# EAGLE design Startgate Controller Motherboard (EAGLE 7.7.0)
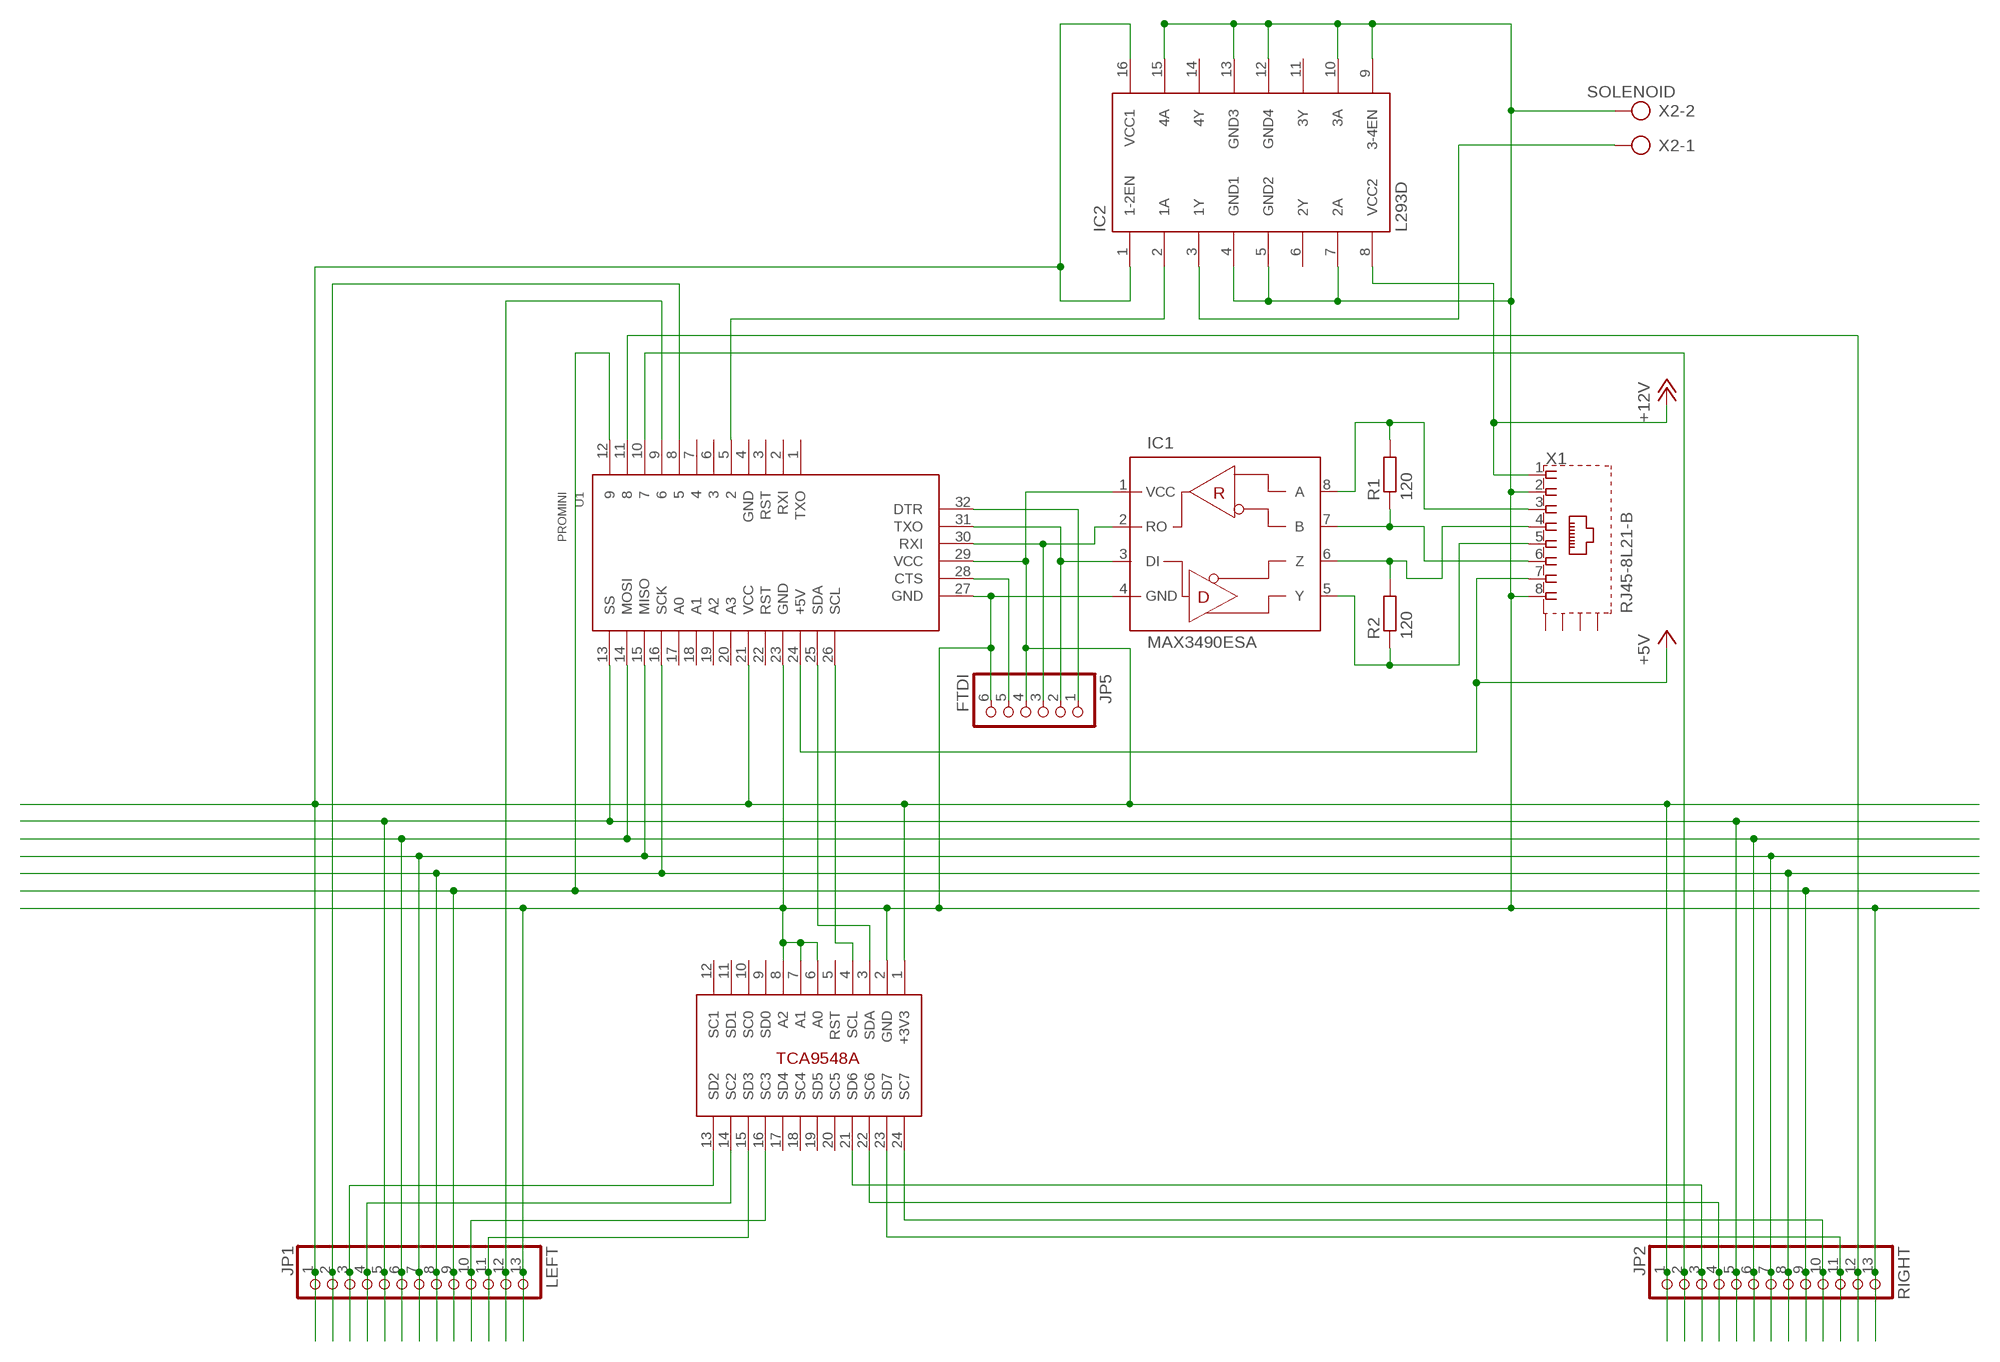
[diagram p0: schematic, sheet 1]

## Parts
IC1  MAX3490ESA  [SO08]
IC2  L293D  [DIL16]
JP1  LEFT  PINHD-1X13  [1X13]
JP2  RIGHT  PINHD-1X13  [1X13]
JP5  FTDI  PINHD-1X6  [1X06]
R1  120  R-EU_R0805  [R0805]
R2  120  R-EU_R0805  [R0805]
U1  PROMINI  ARDUINOPROMINI  [ARDUINOPROMINI]
U2  TCA9548A  [DIL24]
X1  RJ45-8L21-B  [RJ45-SHIELD1]
X2  SOLENOID  AK300/2  [AK300/2]

## Nets
+3V3: IC1.1(VCC) IC2.1(1-2EN) IC2.16(VCC1) JP1.1 JP2.1 JP5.4 U1.21(VCC) U1.29(VCC) U2.1(+3V3)
+5V: U1.24(+5V) X1.7
+12V: IC2.8(VCC2) X1.1
ENA1: JP1.2 U1.8
ENA2: JP1.12 U1.9
ENA3: JP2.2 U1.10
ENA4: JP2.12 U1.11
GND: IC1.4(GND) IC2.4(GND1) IC2.5(GND2) IC2.7(2A) IC2.9(3-4EN) IC2.10(3A) IC2.12(GND4) IC2.13(GND3) IC2.15(4A) JP1.13 JP2.13 JP5.6 U1.23(GND) U1.27(GND) U2.2(GND) U2.6(A0) U2.7(A1) U2.8(A2) X1.2 X1.8 X2.2
MISO: JP1.7 JP2.7 U1.15(MISO)
MOSI: JP1.6 JP2.6 U1.14(MOSI)
N$1: IC1.3(DI) JP5.2 U1.31(TXO)
N$2: IC1.2(RO) JP5.3 U1.30(RXI)
N$3: IC1.8(A) R1.2 X1.3
N$4: IC1.7(B) R1.1 X1.6
N$5: U1.26(SCL) U2.4(SCL)
N$6: U1.25(SDA) U2.3(SDA)
N$7: IC1.5(Y) R2.1 X1.5
N$8: IC1.6(Z) R2.2 X1.4
N$9: JP5.1 U1.32(DTR)
N$10: IC2.2(1A) U1.5
N$11: IC2.3(1Y) X2.1
N$12: JP5.5 U1.28(CTS)
RST: JP1.9 JP2.9 U1.12
SCK: JP1.8 JP2.8 U1.16(SCK)
SCL1: JP1.4 U2.14(SC2)
SCL2: JP1.10 U2.16(SC3)
SCL3: JP2.4 U2.22(SC6)
SCL4: JP2.10 U2.24(SC7)
SDA1: JP1.3 U2.13(SD2)
SDA2: JP1.11 U2.15(SD3)
SDA3: JP2.3 U2.21(SD6)
SDA4: JP2.11 U2.23(SD7)
SS: JP1.5 JP2.5 U1.13(SS)
Unconnected: IC2.6(2Y) IC2.11(3Y) IC2.14(4Y) U1.1(TXO) U1.2(RXI) U1.3(RST) U1.4(GND) U1.6 U1.7 U1.17(A0) U1.18(A1) U1.19(A2) U1.20(A3) U1.22(RST) U2.5(RST) U2.9(SD0) U2.10(SC0) U2.11(SD1) U2.12(SC1) U2.17(SD4) U2.18(SC4) U2.19(SD5) U2.20(SC5) X1.S1(S) X1.S2(S) X1.S3(S) X1.S4(S)

## Library data of the parts
IC1 = miro:MAX3490: +3.3V 10Mbps, RS-485 Transceivers
IC2 = st-microelectronics:L293D: PUSH-PULL 4 CHANNEL DRIVER; MPN: L293D; OC_FARNELL: 9589619; OC_NEWARK: 56P8249
JP1 JP2 = pinhead:PINHD-1X13: PIN HEADER
JP5 = pinhead:PINHD-1X6: PIN HEADER
R1 R2 = resistor:R-EU_: RESISTOR, European symbol
U1 = miro:ARDUINOPROMINI: Arduino Pro Mini - the compete module
U2 = miro:TCA9548A: TCA9548A is a low-voltage 8-channel I2C multiplexer
X1 = con-tycoelectronics:RJ45*2: RJ45 Low Profile Shield Type 2 For all RJ45 L, LC, LCT and X Series Models Source: www.tycoelectronics.com .. ENG_DS_1654001_1099_RJ_L_0507.pdf; OC_FARNELL: unknown; OC_NEWARK: unknown
X2 = con-ptr500:AK300/2: CONNECTOR; OC_FARNELL: unknown; OC_NEWARK: unknown

## Board
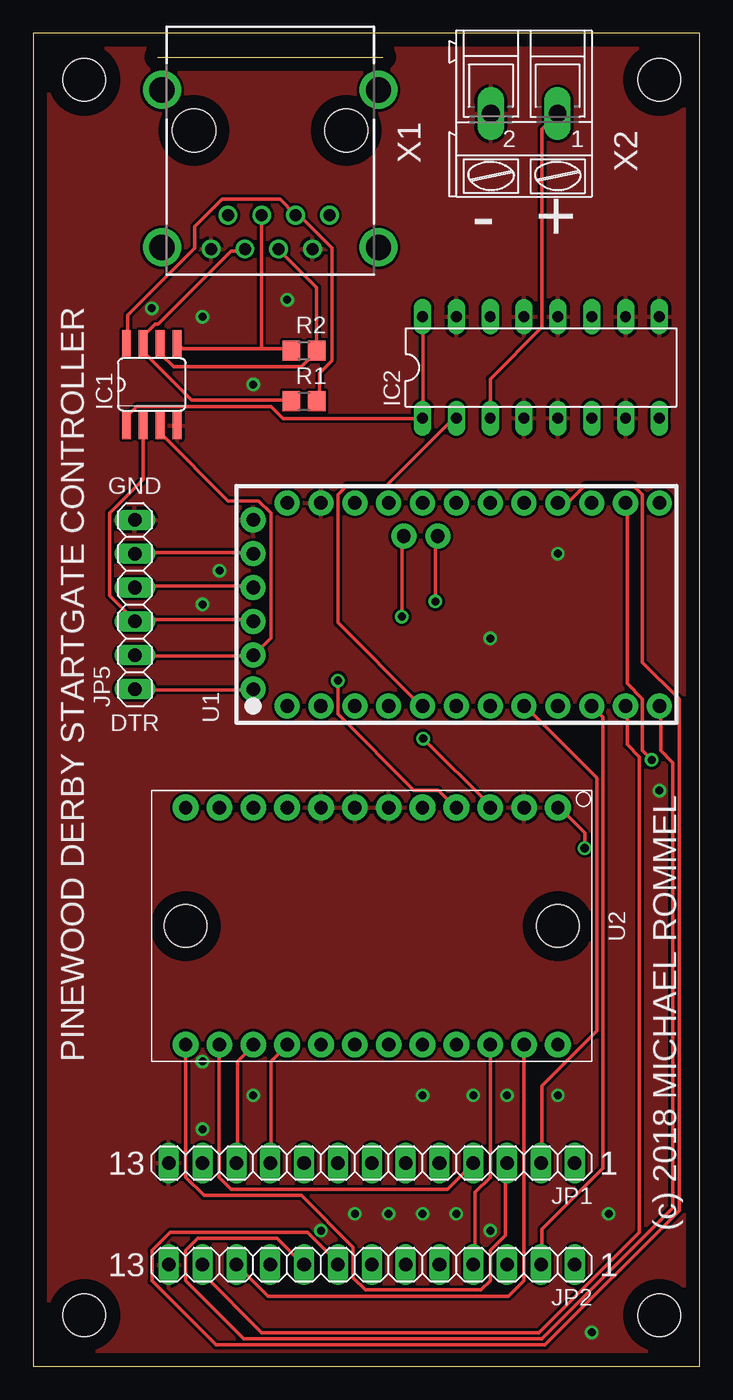
[diagram p1: board, top side]
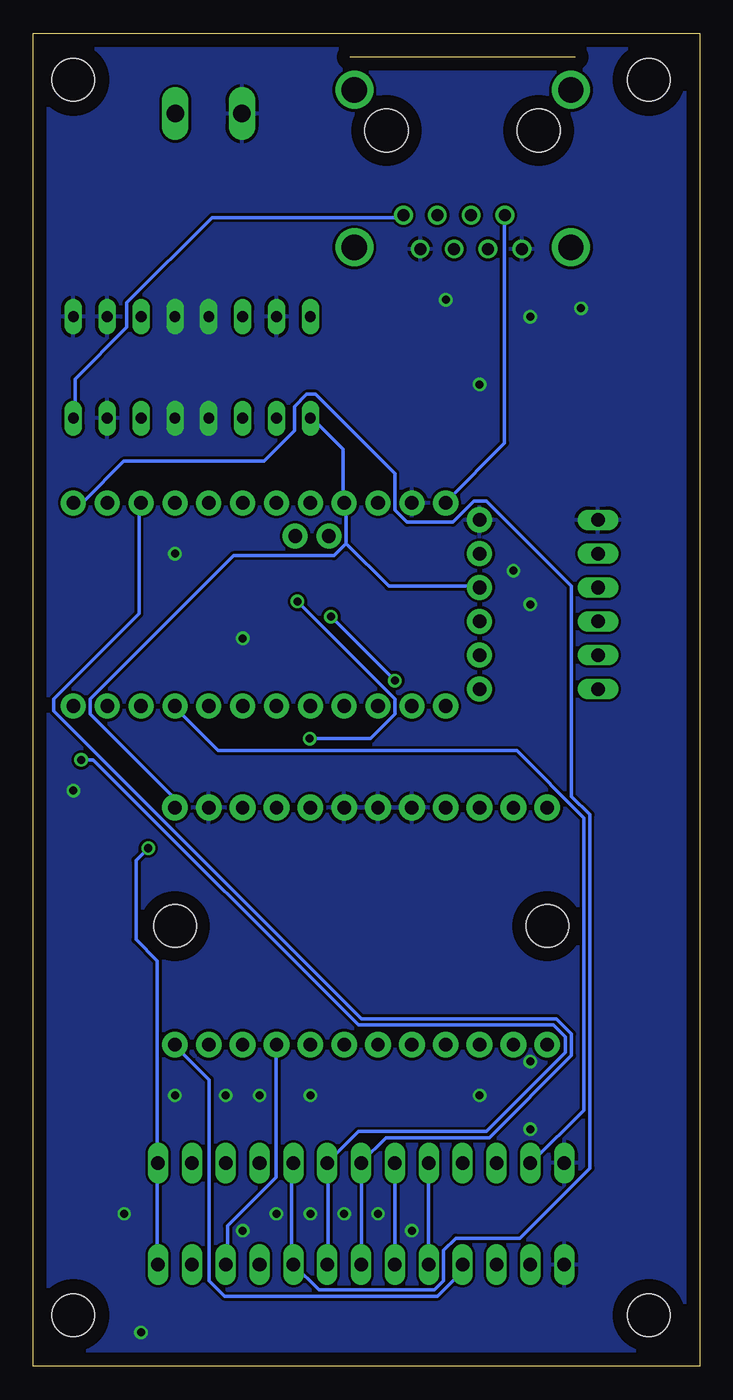
[diagram p2: board, bottom side, seen from below]

Size 50 x 100 mm. Coordinates in mm from the lower left corner, seen from the top.
Outline: 0,0 50,0 50,100 0,100 0,0
Copper layers (1*16): Top 0.035mm / dielectric 1.5mm / Bottom 0.035mm
Design rules "default": minimum track width 10mil, minimum drill 24mil, track to track 8mil, track to pad 8mil, pad to pad 8mil, via to via 8mil, smd to smd 8mil, copper to edge 40mil, drill to drill 8mil, minimum pad ring 10mil, minimum via ring 8mil, stop-mask expansion 4mil, vias tented up to drill 0mil, thermal gap 10mil
Holes 3.2 mm at 3.81,96.52 46.99,96.52 3.81,3.81 46.99,3.81
tRestrict: area 1.3,94 to 6.3,99.1; area 44.5,94 to 49.5,99.1; area 44.5,1.3 to 49.5,6.3; area 1.3,1.3 to 6.3,6.3
bRestrict: area 1.3,94 to 6.3,99.1; area 44.5,94 to 49.5,99.1; area 44.5,1.3 to 49.5,6.3; area 1.3,1.3 to 6.3,6.3

### Footprints (pad centres in the part's own frame; a part is rotated, then mirrored left to right if it is on the bottom)
SO08 = smd 0.66 x 2.032: 1 -1.905,-3.073; 2 -0.635,-3.073; 3 0.635,-3.073; 4 1.905,-3.073; 5 1.905,3.073; 6 0.635,3.073; 7 -0.635,3.073; 8 -1.905,3.073
DIL16 = drill 0.813 long: 1 -8.89,-3.81; 2 -6.35,-3.81; 3 -3.81,-3.81; 4 -1.27,-3.81; 5 1.27,-3.81; 6 3.81,-3.81; 7 6.35,-3.81; 8 8.89,-3.81; 9 8.89,3.81; 10 6.35,3.81; 11 3.81,3.81; 12 1.27,3.81; 13 -1.27,3.81; 14 -3.81,3.81; 15 -6.35,3.81; 16 -8.89,3.81
1X13 = drill 1.016 long: 1 -15.24,0; 2 -12.7,0; 3 -10.16,0; 4 -7.62,0; 5 -5.08,0; 6 -2.54,0; 7 0,0; 8 2.54,0; 9 5.08,0; 10 7.62,0; 11 10.16,0; 12 12.7,0; 13 15.24,0
1X06 = drill 1.016 long: 1 -6.35,0; 2 -3.81,0; 3 -1.27,0; 4 1.27,0; 5 3.81,0; 6 6.35,0
R0805 = smd 1.3 x 1.5: 1 -0.95,0; 2 0.95,0
ARDUINOPROMINI = drill 1.016 pad 1.88: 1 1.27,29.21; 2 1.27,26.67; 3 1.27,24.13; 4 1.27,21.59; 5 1.27,19.05; 6 1.27,16.51; 7 1.27,13.97; 8 1.27,11.43; 9 1.27,8.89; 10 1.27,6.35; 11 1.27,3.81; 12 1.27,1.27; 13 16.51,1.27; 14 16.51,3.81; 15 16.51,6.35; 16 16.51,8.89; 17 16.51,11.43; 18 16.51,13.97; 19 16.51,16.51; 20 16.51,19.05; 21 16.51,21.59; 22 16.51,24.13; 23 16.51,26.67; 24 16.51,29.21; 25 14.021,17.907; 26 14.021,20.447; 27 15.24,31.75; 28 12.7,31.75; 29 10.16,31.75; 30 7.62,31.75; 31 5.08,31.75; 32 2.54,31.75
DIL24 = drill 1 pad 1.93: 1 1.27,30.48; 2 1.27,27.94; 3 1.27,25.4; 4 1.27,22.86; 5 1.27,20.32; 6 1.27,17.78; 7 1.27,15.24; 8 1.27,12.7; 9 1.27,10.16; 10 1.27,7.62; 11 1.27,5.08; 12 1.27,2.54; 13 19.05,2.54; 14 19.05,5.08; 15 19.05,7.62; 16 19.05,10.16; 17 19.05,12.7; 18 19.05,15.24; 19 19.05,17.78; 20 19.05,20.32; 21 19.05,22.86; 22 19.05,25.4; 23 19.05,27.94; 24 19.05,30.48 | hole 3.2: 10.16,30.48; 10.16,2.54
RJ45-SHIELD1 = drill 0.9 pad 1.4: 1 -4.445,6.35; 2 -3.175,8.89; 3 -1.905,6.35; 4 -0.635,8.89; 5 0.635,6.35; 6 1.905,8.89; 7 3.175,6.35; 8 4.445,8.89 | drill 1.9 pad 2.5: S1 -8.128,-3.048; S2 8.128,-3.048; S3 -8.128,8.76; S4 8.128,8.76 | hole 3.251: -5.715,0; 5.715,0
AK300/2 = drill 1.321 long: 1 -2.515,0; 2 2.489,0

### Placement (x,y rotation side)
IC1  8.89,73.66 0 top
IC2  38.1,74.93 0 top
JP1  25.4,15.24 180 top
JP2  25.4,7.62 180 top
JP5  7.62,57.15 90 top
R1  20.32,72.39 0 top
R2  20.32,76.2 0 top
U1  48.26,48.26 90 top
U2  8.89,43.18 270 top
X1  17.78,92.71 180 top
X2  36.83,93.98 180 top

### Tracks (layer width: path | path; a pad name or v marks a point on that pad's centre or on a via)
+3V3  (via drill 0.61)
  Top 0.254: JP5.4 7.77,58.52 16.46,58.52 U1.29 | IC1.1 7.09,70.64 7.09,71.32 7.77,72.01 17.83,72.01 18.75,71.09 29.03,71.09 IC2.1 29.26,71.32 29.26,78.64 IC2.16 | v41.38,38.86 41.38,40.01 39.55,41.83 U2.1
  Bottom 0.254: JP2.1 40.69,7.77 40.69,15.09 JP1.1 40.69,15.32 40.69,30.4 42.29,32 42.29,37.95 v41.38,38.86 | IC2.1 29.03,71.09 26.75,68.81 26.75,64.92 U1.21 26.52,64.69 26.52,61.72 | 26.52,61.72 27.43,60.81 34.98,60.81 45.72,50.06 45.72,48.92 39.55,42.75 39.55,42.06 U2.1 | 26.52,61.72 23.32,58.52 16.69,58.52 U1.29
+5V
  Bottom 0.254: X1.7 14.63,86.18 14.63,69.27 18.97,64.92 U1.24
+12V
  Bottom 0.254: IC2.8 46.86,71.32 46.86,74.07 42.98,77.95 42.98,79.78 36.58,86.18 22.4,86.18 X1.1
ENA1
  Top 0.254: JP1.2 38.18,15.32 38.18,21.03 42.29,25.15 42.29,44.12 37.03,49.38 U1.8
ENA2
  Bottom 0.254: JP1.12 12.57,15.32 8.69,19.2 8.69,41.15 13.72,46.18 36.12,46.18 39.32,49.38 U1.9
ENA3
  Top 0.254: U1.10 42.75,48.69 42.75,14.86 38.18,10.29 38.18,7.77 JP2.2
ENA4
  Top 0.254: JP2.12 12.8,7.54 12.8,6.86 17.14,2.52 37.95,2.52 45.49,10.06 45.49,45.72 44.58,46.63 44.58,49.38 U1.11
GND  (via drill 0.6)
  other vias: 34.29,54.61 39.37,60.96 43.18,11.43 19.05,80.01 16.51,73.66 12.7,78.74 8.89,79.38 12.7,57.15 13.97,59.69 41.91,2.54 46.99,43.18 21.59,10.16 12.7,17.78 12.7,22.86 29.21,20.32 16.51,20.32 33.02,20.32 35.56,20.32 29.21,11.43 26.67,11.43 24.13,11.43 31.75,11.43 39.37,20.32 34.29,10.16
  pour Top: 0,100.33 50.8,100.33 50.8,0 0,0
  pour Bottom: 0,100.33 50.8,100.33 50.8,0 0,0
  pour Bottom (no thermals): 35.56,81.28 40.64,81.28 40.64,68.58 35.56,68.58
MISO
  Bottom 0.254: JP2.7 25.38,7.77 25.38,15.09 JP1.7 25.38,15.32 23.55,17.14 15.77,17.14 9.6,23.32 9.6,24.92 10.74,26.06 25.38,26.06 48.46,49.15 48.46,50.06 42.06,56.46 42.06,64.69 U1.15
MOSI  (via drill 0.61)
  Top 0.254: v46.41,45.49 45.72,46.18 45.72,50.06 44.58,51.21 44.58,64.69 U1.14
  Bottom 0.254: JP2.6 27.89,7.77 27.89,15.09 JP1.6 27.89,15.32 25.6,17.6 16,17.6 10.06,23.55 10.06,24.69 10.97,25.6 25.6,25.6 45.49,45.49 v46.41,45.49
N$1
  Top 0.254: IC1.3 9.6,70.41 9.6,69.95 14.63,64.92 16.92,64.92 17.83,64.01 17.83,54.63 16.69,53.49 U1.31 16.46,53.26 7.77,53.26 JP5.2
N$2
  Top 0.254: IC1.2 8.23,70.41 8.23,66.52 5.71,64.01 5.71,57.84 7.54,56.01 JP5.3 7.77,56.01 16.46,56.01 U1.30
N$3
  Top 0.254: R1.2 21.49,72.47 21.49,74.52 22.4,75.44 22.4,83.9 19.89,86.41 X1.3 19.66,86.41 18.52,87.55 14.17,87.55 12.12,85.5 12.12,83.9 7.09,78.87 7.09,76.81 IC1.8
N$4
  Top 0.254: R1.1 19.2,72.47 11.89,72.47 8.46,75.89 8.46,76.58 IC1.7 8.46,76.81 8.46,77.5 9.14,78.18 9.37,78.18 14.86,83.67 15.77,83.67 X1.6
N$5  (via drill 0.61)
  Top 0.254: v27.66,56.24 27.66,62.18 U1.26 | v22.86,51.44 22.86,48.92 28.57,43.2 30.4,43.2 31.55,42.06 U2.4
  Bottom 0.254: v22.86,51.44 v27.66,56.24
N$6  (via drill 0.61)
  Top 0.254: v30.18,57.38 30.18,62.18 U1.25 | v29.26,47.09 34.29,42.06 U2.3
  Bottom 0.254: v30.18,57.38 22.86,50.06 22.86,48.92 24.69,47.09 v29.26,47.09
N$7
  Top 0.254: 17.14,76.35 11.2,76.35 10.97,76.58 IC1.5 | 17.14,76.35 19.2,76.35 R2.1 | 17.14,76.35 X1.5
N$8
  Top 0.254: X1.4 18.52,83.67 21.26,80.92 21.26,76.35 R2.2 21.26,76.12 20.12,74.98 10.52,74.98 9.6,75.89 9.6,76.58 IC1.6
N$9
  Top 0.254: JP5.1 7.77,50.75 16.46,50.75 U1.32
N$10
  Top 0.254: IC2.2 31.55,71.09 26.52,66.06 23.55,66.06 22.86,65.38 22.86,55.78 29.03,49.61 U1.5
N$11
  Top 0.254: IC2.3 34.29,74.07 38.18,77.95 38.18,92.81 X2.1
N$12
  Top 0.254: JP5.5 7.77,61.04 16.46,61.04 U1.28
RST
  Top 0.254: U1.12 47.09,49.38 47.09,46.18 48.01,45.26 48.01,11.89 38.18,2.06 15.77,2.06 11.43,6.4 11.43,8.69 12.34,9.6 18.29,9.6 20.12,7.77 JP2.9
  Bottom 0.254: JP2.9 20.34,7.77 20.34,15.09 JP1.9
SCK
  Top 0.254: U1.16 39.55,64.92 40.23,64.92 41.38,66.06 45.03,66.06 45.72,65.38 45.72,52.81 48.46,50.06 48.46,11.66 38.41,1.6 13.72,1.6 8.91,6.4 8.91,8.69 10.29,10.06 20.57,10.06 22.86,7.77 JP2.8
  Bottom 0.254: JP1.8 JP2.8
SCL1
  Top 0.254: JP1.4 32.92,15.09 31.09,13.26 14.86,13.26 13.95,14.17 13.95,24 U2.14
SCL2
  Top 0.254: JP1.10 17.83,15.32 17.83,22.86 18.97,24 U2.16
SCL3
  Top 0.254: U2.22 34.29,14.17 33.15,13.03 33.15,7.77 JP2.4
SCL4
  Bottom 0.254: JP2.10 17.83,7.54 17.83,7.09 19.66,5.26 35.66,5.26 36.8,6.4 36.8,21.49 39.32,24 U2.24
SDA1
  Top 0.254: U2.13 11.43,14.17 12.8,12.8 20.12,12.8 24,8.91 24,6.63 24.92,5.71 33.6,5.71 34.29,6.4 34.29,8.69 35.43,9.83 35.43,15.09 JP1.3
SDA2
  Top 0.254: JP1.11 15.32,15.32 15.32,22.86 16.46,24 U2.15
SDA3
  Bottom 0.254: JP2.3 35.43,7.77 35.43,10.52 31.77,14.17 31.77,24 U2.21
SDA4
  Top 0.254: JP2.11 17.6,5.26 35.66,5.26 36.8,6.4 36.8,24 U2.23
SS
  Bottom 0.254: JP1.5 30.63,15.09 30.63,7.77 JP2.5 28.57,5.71 19.89,5.71 19.2,6.4 19.2,8.69 18.29,9.6 13.49,9.6 8.23,14.86 8.23,41.38 9.6,42.75 9.6,58.52 16,64.92 16.92,64.92 18.52,63.32 21.95,63.32 22.86,64.24 22.86,66.98 28.8,72.92 29.49,72.92 30.4,72.01 30.4,70.18 32.69,67.89 43.2,67.89 46.18,64.92 46.86,64.92 U1.13

### Text on the board
tNames: - + | GND | DTR | PINEWOOD DERBY STARTGATE CONTROLLER | 13 | 1 | (c) 2018 MICHAEL ROMMEL | 13 | 1